# EAGLE design gomaDOSzero (EAGLE 9.0.0)
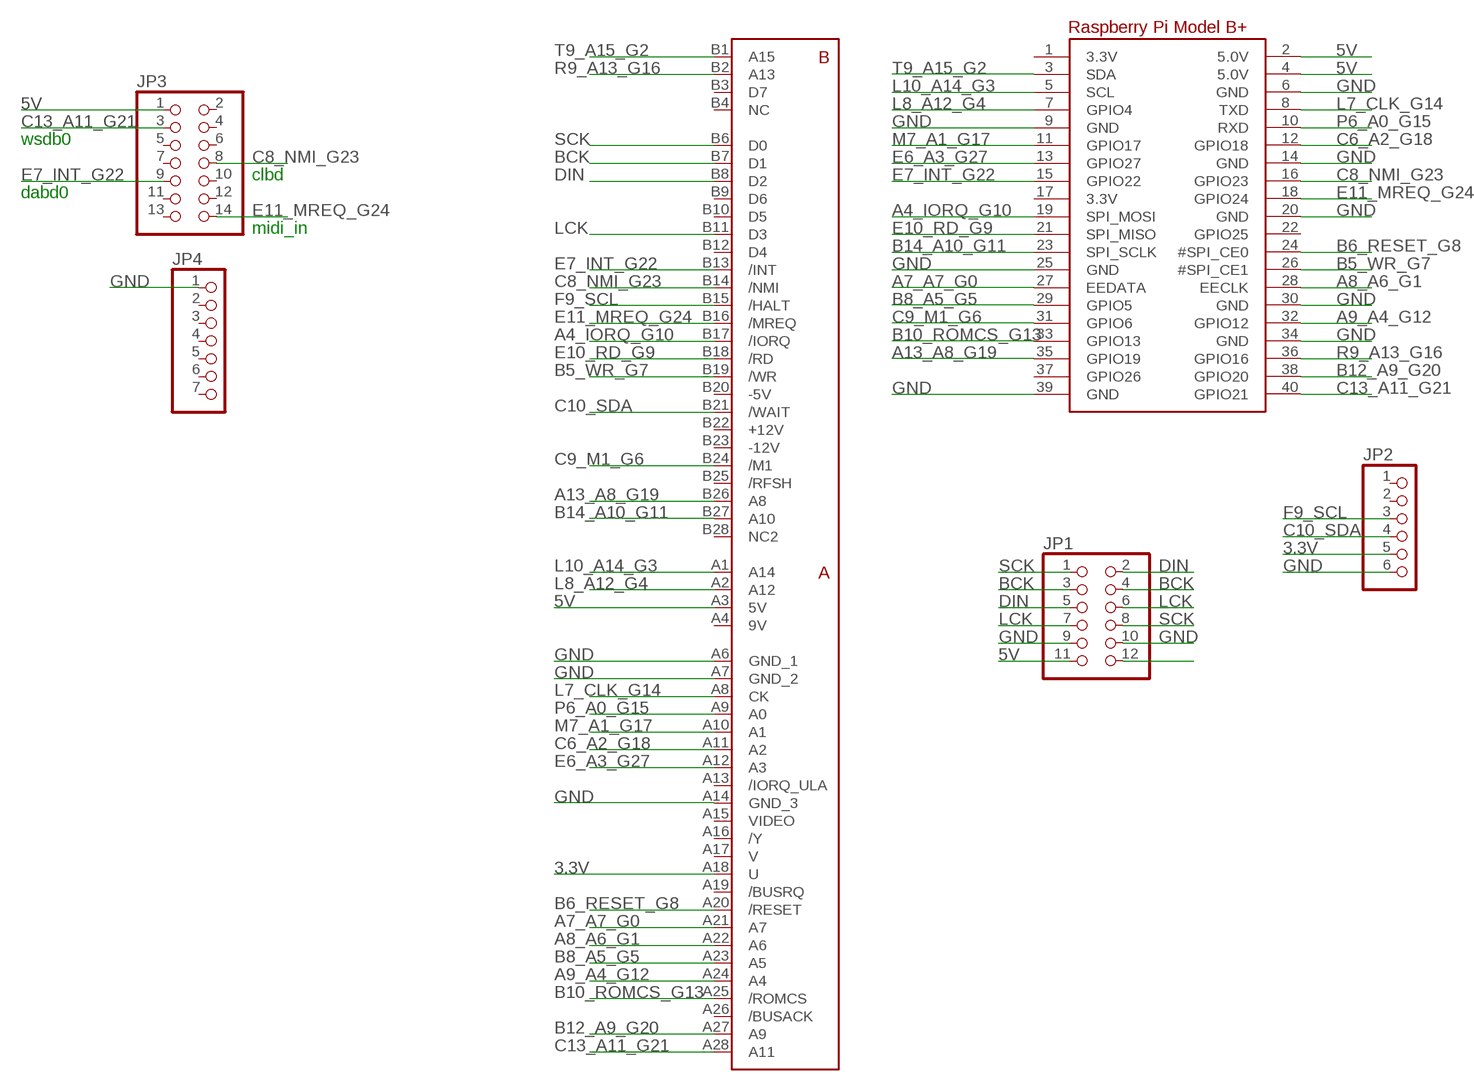
[diagram p0: schematic, sheet 1]

## Parts
JP1  PINHD-2X6  [2X06]
JP2  PINHD-1X6/90  [1X06/90]
JP3  PINHD-2X07_2.00  [2X07M]
JP4  PINHD-1X07_2.00  [1X07M]
RPI1  RASPBERRYPI_BPLUS_BONNETNODIM  [PI_BONNET_NODIM]
U$1  ZXSP_ED2X28_SPE_SOL_EDGE  [2X28_SPE2]

## Nets
3.3V: JP2.5 U$1.A18(U)
5V: JP1.11 JP1.12 JP3.1 RPI1.2(5.0V) RPI1.4(5.0V) U$1.A3(5V)
A4_IORQ_G10: RPI1.19(SPI_MOSI) U$1.B17(/IORQ)
A7_A7_G0: RPI1.27(EEDATA) U$1.A21(A7)
A8_A6_G1: RPI1.28(EECLK) U$1.A22(A6)
A9_A4_G12: RPI1.32(GPIO12) U$1.A24(A4)
A13_A8_G19: RPI1.35(GPIO19) U$1.B26(A8)
B5_WR_G7: RPI1.26(#SPI_CE1) U$1.B19(/WR)
B6_RESET_G8: RPI1.24(#SPI_CE0) U$1.A20(/RESET)
B8_A5_G5: RPI1.29(GPIO5) U$1.A23(A5)
B10_ROMCS_G13: RPI1.33(GPIO13) U$1.A25(/ROMCS)
B12_A9_G20: RPI1.38(GPIO20) U$1.A27(A9)
B14_A10_G11: RPI1.23(SPI_SCLK) U$1.B27(A10)
BCK: JP1.3 JP1.4 U$1.B7(D1)
C6_A2_G18: RPI1.12(GPIO18) U$1.A11(A2)
C8_NMI_G23: JP3.8 RPI1.16(GPIO23) U$1.B14(/NMI)
C9_M1_G6: RPI1.31(GPIO6) U$1.B24(/M1)
C10_SDA: JP2.4 U$1.B21(/WAIT)
C13_A11_G21: JP3.3 RPI1.40(GPIO21) U$1.A28(A11)
DIN: JP1.2 JP1.5 U$1.B8(D2)
E6_A3_G27: RPI1.13(GPIO27) U$1.A12(A3)
E7_INT_G22: JP3.9 RPI1.15(GPIO22) U$1.B13(/INT)
E10_RD_G9: RPI1.21(SPI_MISO) U$1.B18(/RD)
E11_MREQ_G24: JP3.14 RPI1.18(GPIO24) U$1.B16(/MREQ)
F9_SCL: JP2.3 U$1.B15(/HALT)
GND: JP1.9 JP1.10 JP2.6 JP4.1 RPI1.6(GND) RPI1.9(GND) RPI1.14(GND) RPI1.20(GND) RPI1.25(GND) RPI1.30(GND) RPI1.34(GND) RPI1.39(GND) U$1.A6(GND_1) U$1.A7(GND_2) U$1.A14(GND_3)
L7_CLK_G14: RPI1.8(TXD) U$1.A8(CK)
L8_A12_G4: RPI1.7(GPIO4) U$1.A2(A12)
L10_A14_G3: RPI1.5(SCL) U$1.A1(A14)
LCK: JP1.6 JP1.7 U$1.B11(D3)
M7_A1_G17: RPI1.11(GPIO17) U$1.A10(A1)
P6_A0_G15: RPI1.10(RXD) U$1.A9(A0)
R9_A13_G16: RPI1.36(GPIO16) U$1.B2(A13)
SCK: JP1.1 JP1.8 U$1.B6(D0)
T9_A15_G2: RPI1.3(SDA) U$1.B1(A15)
Unconnected: JP2.1 JP2.2 JP3.2 JP3.4 JP3.5 JP3.6 JP3.7 JP3.10 JP3.11 JP3.12 JP3.13 JP4.2 JP4.3 JP4.4 JP4.5 JP4.6 JP4.7 RPI1.1(3.3V) RPI1.17(3.3V) RPI1.22(GPIO25) RPI1.37(GPIO26) U$1.A13(/IORQ_ULA) U$1.A15(VIDEO) U$1.A16(/Y) U$1.A17(V) U$1.A19(/BUSRQ) U$1.A26(/BUSACK) U$1.B3(D7) U$1.B4(NC) U$1.B9(D6) U$1.B10(D5) U$1.B12(D4) U$1.B25(/RFSH) U$1.B28(NC2)

## Notes on the sheet
- wsdb0
- clbd
- dabd0
- midi_in

## Power pins joined to a net without a drawn wire
9V: U$1.A4(9V)
+12V: U$1.B22(+12V)
-5V: U$1.B20(-5V)
-12V: U$1.B23(-12V)

## Library data of the parts
JP1 = pinhead:PINHD-2X6: PIN HEADER
JP2 = pinhead:PINHD-1X6: PIN HEADER
JP3 = pinhead-2:PINHD-2X07: PIN HEADER
JP4 = pinhead-2:PINHD-1X07: PIN HEADER
RPI1 = microbuilder:RASPBERRYPI_BPLUS
U$1 = zx_edge:ZXSP_ED

## Net classes
1 GND: width 0.254 mm
2 VCC: width 0.254 mm

## Board
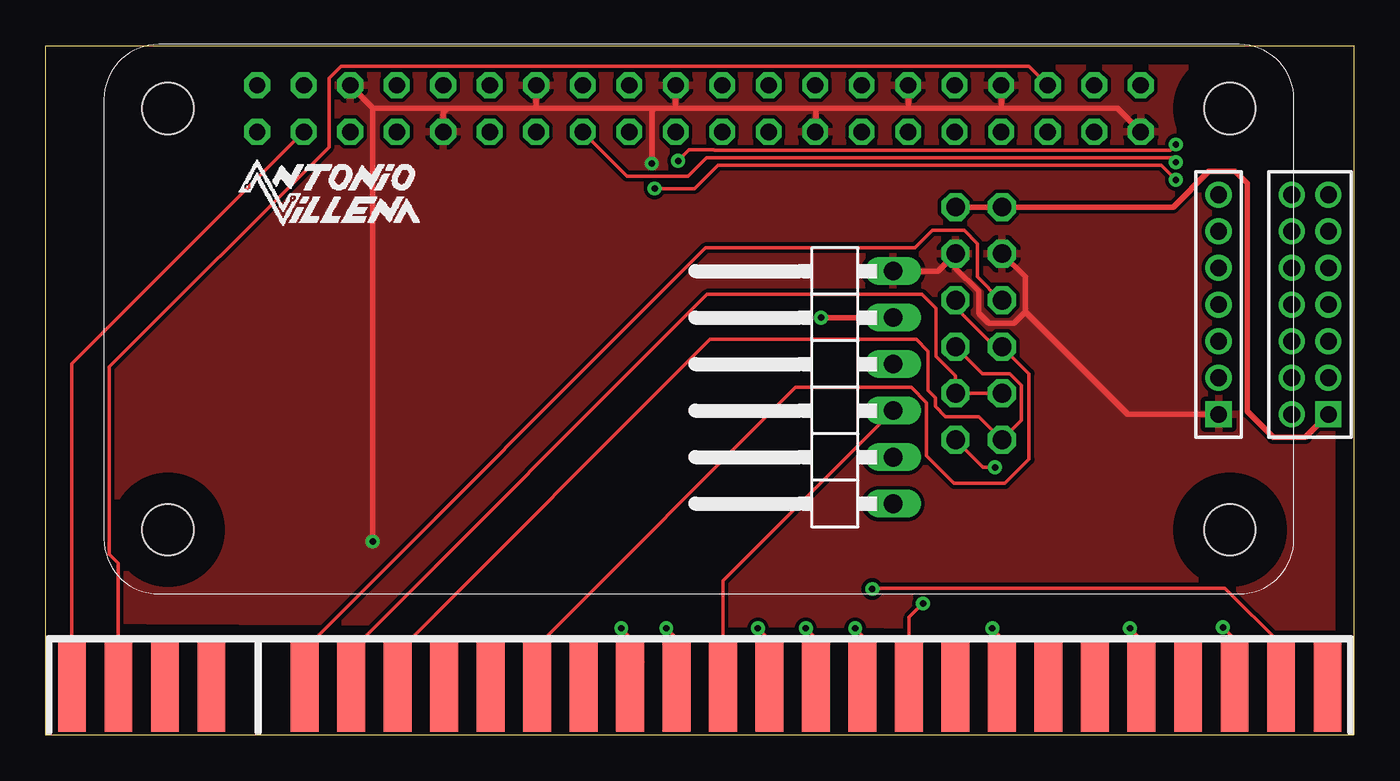
[diagram p1: board, top side]
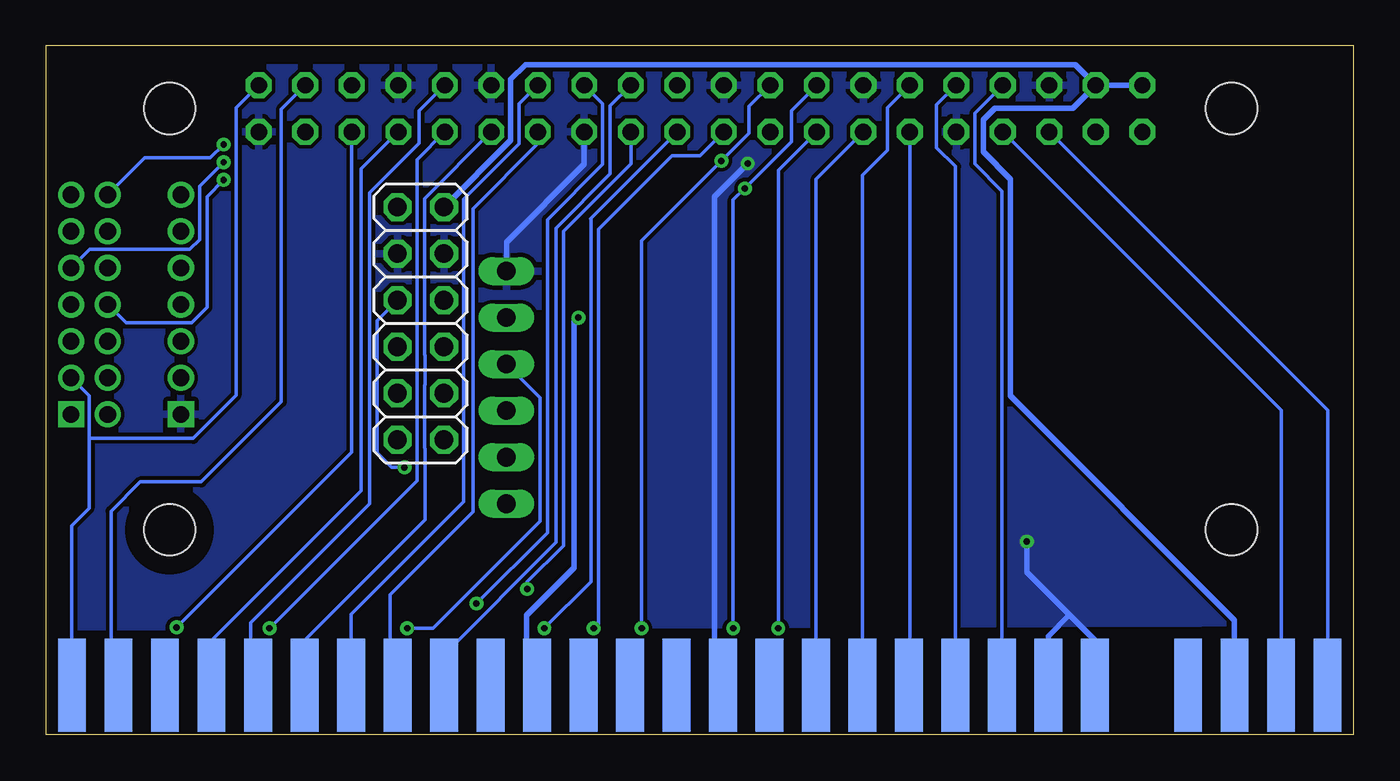
[diagram p2: board, bottom side, seen from below]

Size 71.44 x 37.62 mm. Coordinates in mm from the lower left corner, seen from the top.
Outline: 0,0 0,37.62 71.44,37.62 71.44,0 0,0
Copper layers (1*16): Top 0.035mm / dielectric 1.5mm / Bottom 0.035mm
Design rules "default *": minimum track width 10mil, minimum drill 24mil, track to track 8mil, track to pad 8mil, pad to pad 8mil, via to via 8mil, smd to smd 8mil, copper to edge 40mil, drill to drill 8mil, minimum pad ring 10mil, minimum via ring 8mil, stop-mask expansion 4mil, vias tented up to drill 20mil, thermal gap 10mil

### Footprints (pad centres in the part's own frame; a part is rotated, then mirrored left to right if it is on the bottom)
2X06 = drill 1.016 octagon: 1 -6.35,-1.27; 2 -6.35,1.27; 3 -3.81,-1.27; 4 -3.81,1.27; 5 -1.27,-1.27; 6 -1.27,1.27; 7 1.27,-1.27; 8 1.27,1.27; 9 3.81,-1.27; 10 3.81,1.27; 11 6.35,-1.27; 12 6.35,1.27
1X06/90 = drill 1.016 long: 1 -6.35,-3.81; 2 -3.81,-3.81; 3 -1.27,-3.81; 4 1.27,-3.81; 5 3.81,-3.81; 6 6.35,-3.81
2X07M = drill 0.914 square: 1 -6,-1 | drill 0.914: 2 -6,1; 3 -4,-1; 4 -4,1; 5 -2,-1; 6 -2,1; 7 0,-1; 8 0,1; 9 2,-1; 10 2,1; 11 4,-1; 12 4,1; 13 6,-1; 14 6,1
1X07M = drill 0.914 square: 1 -6,0 | drill 0.914: 2 -4,0; 3 -2,0; 4 0,0; 5 2,0; 6 4,0; 7 6,0
PI_BONNET_NODIM = drill 0.9 octagon: 1 8.37,25.23; 2 8.37,27.77; 3 10.91,25.23; 4 10.91,27.77; 5 13.45,25.23; 6 13.45,27.77; 7 15.99,25.23; 8 15.99,27.77; 9 18.53,25.23; 10 18.53,27.77; 11 21.07,25.23; 12 21.07,27.77; 13 23.61,25.23; 14 23.61,27.77; 15 26.15,25.23; 16 26.15,27.77; 17 28.69,25.23; 18 28.69,27.77; 19 31.23,25.23; 20 31.23,27.77; 21 33.77,25.23; 22 33.77,27.77; 23 36.31,25.23; 24 36.31,27.77; 25 38.85,25.23; 26 38.85,27.77; 27 41.39,25.23; 28 41.39,27.77; 29 43.93,25.23; 30 43.93,27.77; 31 46.47,25.23; 32 46.47,27.77; 33 49.01,25.23; 34 49.01,27.77; 35 51.55,25.23; 36 51.55,27.77; 37 54.09,25.23; 38 54.09,27.77; 39 56.63,25.23; 40 56.63,27.77 | hole 2.8: 3.5,3.5; 3.5,26.5; 61.5,26.5; 61.5,3.5
2X28_SPE2 = smd 1.524 x 5.08 bottom: A1 0,0; A2 2.54,0; A3 5.08,0; A4 7.62,0; A6 12.7,0; A7 15.24,0; A8 17.78,0; A9 20.32,0; A10 22.86,0; A11 25.4,0; A12 27.94,0; A13 30.48,0; A14 33.02,0; A15 35.56,0; A16 38.1,0; A17 40.64,0; A18 43.18,0; A19 45.72,0; A20 48.26,0; A21 50.8,0; A22 53.34,0; A23 55.88,0; A24 58.42,0; A25 60.96,0; A26 63.5,0; A27 66.04,0; A28 68.58,0 | smd 1.524 x 5.08: B1 0,0; B2 2.54,0; B3 5.08,0; B4 7.62,0; B6 12.7,0; B7 15.24,0; B8 17.78,0; B9 20.32,0; B10 22.86,0; B11 25.4,0; B12 27.94,0; B13 30.48,0; B14 33.02,0; B15 35.56,0; B16 38.1,0; B17 40.64,0; B18 43.18,0; B19 45.72,0; B20 48.26,0; B21 50.8,0; B22 53.34,0; B23 55.88,0; B24 58.42,0; B25 60.96,0; B26 63.5,0; B27 66.04,0; B28 68.58,0

### Placement (x,y rotation side)
JP1  50.96,22.46 90 bottom
JP2  42.47,18.97 90 top
JP3  69.06,23.5 90 top
JP4  64.06,23.5 90 top
RPI1  3.17,7.7 0 top
U$1  1.43,2.7 0 top

### Tracks (layer width: path | path; a pad name or v marks a point on that pad's centre or on a via)
3.3V  (via drill 0.35)
  Top 0.305: v42.35,22.78 JP2.5
  Bottom 0.305: U$1.A18 44.61,4.37 45.16,4.92 45.16,6.52 42.57,9.11 42.57,22.55 v42.35,22.78
5V
  Top 0.305: JP1.11 JP1.12 61.57,28.81 63.53,30.77 64.95,30.77 65.61,30.11 65.61,17.66 67.04,16.24 68.8,16.24 JP3.1
  Bottom 0.305: U$1.A3 6.51,6.27 18.75,18.51 18.75,30.34 20.24,31.83 20.24,33.58 19.61,34.21 15.34,34.21 RPI1.4 | RPI1.4 RPI1.2 | JP1.11 46.04,32.46 46.04,35.79 45.24,36.59 15.21,36.59 RPI1.4
A4_IORQ_G10  (via drill 0.35)
  Top 0.203: v41.51,5.82 42.07,5.26 U$1.B17
  Bottom 0.203: v41.51,5.82 41.26,6.07 41.26,27.6 37.23,31.63 35.7,31.63 RPI1.19
A7_A7_G0
  Bottom 0.203: U$1.A21 52.63,3.1 52.63,7.66 48.1,12.18 48.1,28.73 44.56,32.27 RPI1.27
A8_A6_G1
  Bottom 0.203: U$1.A22 54.77,6.59 48.62,12.73 48.62,29.23 45.59,32.27 45.59,34.45 RPI1.28
A9_A4_G12
  Bottom 0.203: RPI1.32 51.04,34.08 51.04,32.31 53.75,29.6 53.75,12.61 60.25,6.11 60.25,2.7 59.85,2.3 | 59.69,2.14 59.85,2.3 | 59.85,2.3 U$1.A24
A13_A8_G19  (via drill 0.35)
  Top 0.203: v64.29,5.87 64.93,5.24 U$1.B26
  Bottom 0.203: v64.29,5.87 54.72,15.44 RPI1.35
B5_WR_G7  (via drill 0.35)
  Top 0.203: 47.1,2.19 47.12,2.17 47.15,2.2 U$1.B19 47.15,6.41 v47.91,7.18
  Bottom 0.203: RPI1.26 41.02,34.46 41.02,31.16 44.04,28.13 44.04,11.05 v47.91,7.18
B6_RESET_G8
  Bottom 0.203: U$1.A20 49.69,4.38 43.57,10.51 43.57,27.67 40.61,30.63 40.61,34.34 RPI1.24
B8_A5_G5
  Bottom 0.203: RPI1.29 50.76,29.28 50.76,20.75 50.72,20.72 50.72,19.13 50.76,19.09 50.76,15.67 50.72,15.64 50.72,11.75 57.31,5.16 U$1.A23
B10_ROMCS_G13
  Bottom 0.203: RPI1.33 54.21,30.9 54.21,13.33 62.39,5.16 U$1.A25
B12_A9_G20
  Bottom 0.203: RPI1.38 58.58,34.16 58.58,18.18 62.94,13.81 66.28,13.81 67.87,12.22 67.87,3.1 U$1.A27
B14_A10_G11  (via drill 0.35)
  Top 0.203: U$1.B27 67.47,4.94 64.41,8 45.18,8 v45.14,7.96
  Bottom 0.203: RPI1.23 39.48,31.18 43.16,27.5 43.16,10.34 45.14,8.35 v45.14,7.96
BCK
  Top 0.203: U$1.B7 16.67,4.6 36.12,24.05 47.86,24.05 48.62,23.29 48.62,20.67 49.69,19.61 JP1.3 | JP1.3 JP1.4 | JP1.3 49.69,18.81
C6_A2_G18
  Bottom 0.203: U$1.A11 26.83,30.56 25.48,31.91 25.48,34.23 RPI1.12
C8_NMI_G23  (via drill 0.35)
  Top 0.203: U$1.B14 34.45,5.26 v33.89,5.82 | v61.72,30.3 60.92,31.11 36.71,31.11 35.43,29.83 v33.25,29.83
  Bottom 0.203: v33.89,5.82 33.89,29.21 33.28,29.83 33.27,29.83 | RPI1.16 30.72,34.08 30.72,32.38 33.27,29.83 | JP3.8 67.05,22.49 63.48,22.49 62.63,23.34 62.63,29.39 v61.72,30.3 | v33.25,29.83 33.27,29.83
C9_M1_G6  (via drill 0.35)
  Top 0.203: U$1.B24 59.85,5.18 v59.21,5.82
  Bottom 0.203: RPI1.31 51.16,31.41 51.16,13.87 v59.21,5.82
C10_SDA  (via drill 0.35)
  Top 0.203: U$1.B21 52.23,5.29 v51.69,5.82
  Bottom 0.203: v51.69,5.82 50.28,5.82 48.24,7.86 44.45,11.65 44.45,18.41 JP2.4
C13_A11_G21
  Bottom 0.203: RPI1.40 61.04,34.23 61.04,18.53 63.38,16.19 69.02,16.19 69.07,16.24 | U$1.A28 70.01,11.43 69.07,12.37 69.07,16.24 | JP3.3 69.07,18.51 69.07,16.24
DIN
  Top 0.203: U$1.B8 19.21,4.52 36.27,21.59 47.55,21.59 48.18,20.95 48.18,18.81 48.58,18.41 48.58,17.94 49.13,17.38 50.96,17.38 JP1.2 53.3,17.18 53.3,19.09 52.67,19.72 51.16,19.72 JP1.5
E6_A3_G27
  Bottom 0.203: U$1.A12 29.37,30.35 RPI1.13
E7_INT_G22  (via drill 0.35)
  Top 0.203: v31.43,5.82 31.91,5.34 U$1.B13 31.91,3.25 32.62,3.97 | v61.72,31.27 61.47,31.51 36.08,31.51 35.08,30.51 31.74,30.51 RPI1.15
  Bottom 0.203: v31.43,5.82 31.43,30.82 RPI1.15 | JP3.9 69.05,26.5 63.58,26.5 63.04,27.05 63.04,29.95 v61.72,31.27
E10_RD_G9  (via drill 0.35)
  Top 0.203: v44.21,5.82 44.61,5.42 U$1.B18
  Bottom 0.203: RPI1.21 41.68,28.19 41.66,28.17 41.66,8.37 v44.21,5.82
E11_MREQ_G24  (via drill 0.35)
  Top 0.203: v38.89,5.82 39.53,5.18 U$1.B16 | 34.7,31.5 v34.54,31.34 35.13,31.94 36.51,31.94 36.53,31.92 61.41,31.92 v61.72,32.23
  Bottom 0.203: RPI1.18 33.02,34.31 33.02,32.86 v34.54,31.34 38.89,26.99 v38.89,5.82 | JP3.14 66.05,31.5 62.45,31.5 v61.72,32.23
F9_SCL
  Top 0.203: U$1.B15 36.99,8.41 JP2.3
GND  (via drill 0.35)
  Top 0.305: RPI1.6 17.86,34.23 | 17.86,34.23 17.88,34.21 21.91,34.21 | RPI1.39 58.52,34.21 52.07,34.21 | 21.91,34.21 26.75,34.21 | 26.75,34.21 33.26,34.21 | 33.26,34.21 34.45,34.21 | 34.45,34.21 42.07,34.21 | 42.07,34.21 46.99,34.21 | 46.99,34.21 52.07,34.21 | RPI1.34 52.18,34.33 52.07,34.21 | RPI1.30 47.1,34.33 46.99,34.21 | RPI1.25 42.07,32.97 42.07,34.21 | RPI1.20 34.4,34.25 34.45,34.21 | RPI1.14 26.78,34.25 26.75,34.21 | RPI1.9 21.7,34.01 21.91,34.21 | v17.86,10.56 17.86,34.23 | v33.1,31.19 33.1,34.05 33.26,34.21 | JP2.6 48.74,25.32 JP1.9 49.69,25.48 50.96,24.21 50.96,23.02 51.51,22.46 52.86,22.46 53.5,23.1 | 53.5,23.1 53.5,25 JP1.10 | JP4.1 59.1,17.49 53.5,23.1
  Bottom 0.305: U$1.A6 14.13,5.16 15.52,6.55 | U$1.A7 16.67,5.4 15.52,6.55 | RPI1.25 42.02,31.16 46.28,26.91 JP2.6 | v17.86,10.56 17.86,8.89 15.52,6.55 | U$1.A14 34.92,3.17 34.92,29.37 v33.1,31.19
  pour Bottom: 0.4,37.07 71.04,37.23 70.96,5.87 0.48,6.11
  pour Top: 0.4,37.07 71.04,37.23 70.96,5.87 0.48,6.27
L7_CLK_G14
  Bottom 0.203: U$1.A8 19.21,29.69 20.7,31.17 20.7,33.94 RPI1.8
L8_A12_G4
  Bottom 0.203: U$1.A2 3.97,17.73 RPI1.7
L10_A14_G3
  Bottom 0.203: U$1.A1 1.43,17.73 RPI1.5
LCK
  Top 0.203: U$1.B11 26.83,4.84 40.96,18.97 47.28,18.97 48.1,18.14 48.1,15.24 49.61,13.73 52.39,13.73 53.7,15.05 53.7,19.72 JP1.6 51.83,21.19 49.69,23.34 JP1.7
M7_A1_G17
  Bottom 0.203: RPI1.11 24.24,2.74 U$1.A10
P6_A0_G15
  Bottom 0.203: U$1.A9 21.75,31.04 22.78,32.07 22.78,34.39 RPI1.10
R9_A13_G16
  Top 0.203: U$1.B2 3.97,9.38 3.47,9.87 3.47,20.09 15.47,32.09 15.47,35.85 16.13,36.51 53.69,36.51 RPI1.36
SCK  (via drill 0.35)
  Top 0.203: JP1.8 52.15,23.73 50.88,25 50.88,26.83 50.16,27.54 48.42,27.54 47.47,26.59 36.04,26.59 14.13,4.68 U$1.B6 | JP1.1 51.2,14.6 v51.84,14.6
  Bottom 0.203: v51.84,14.6 52.55,14.6 53.34,15.4 53.34,22.62 JP1.8
T9_A15_G2
  Top 0.203: U$1.B1 1.43,20.27 RPI1.3